# EAGLE design Breadboard (EAGLE 9.4.2)

## Sheet 1 of 2
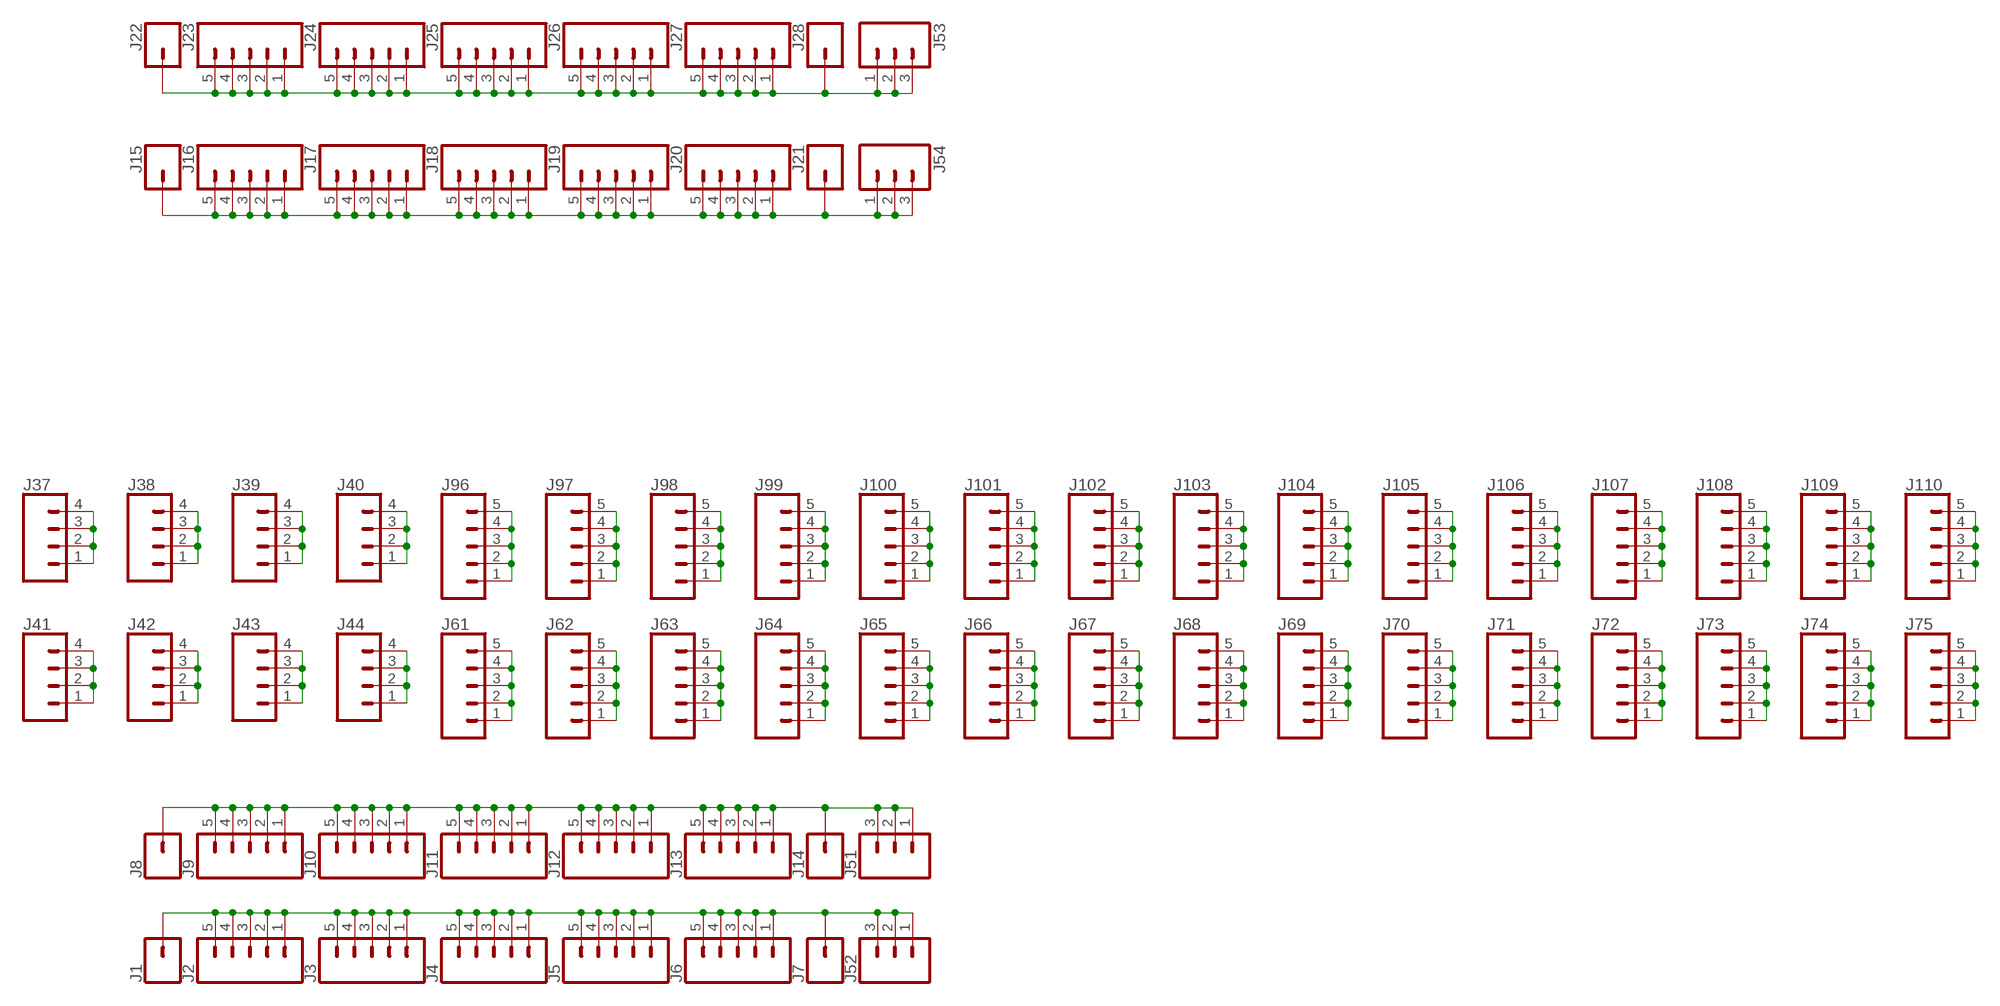
[diagram p0: schematic, sheet 1, part 1 of 2]
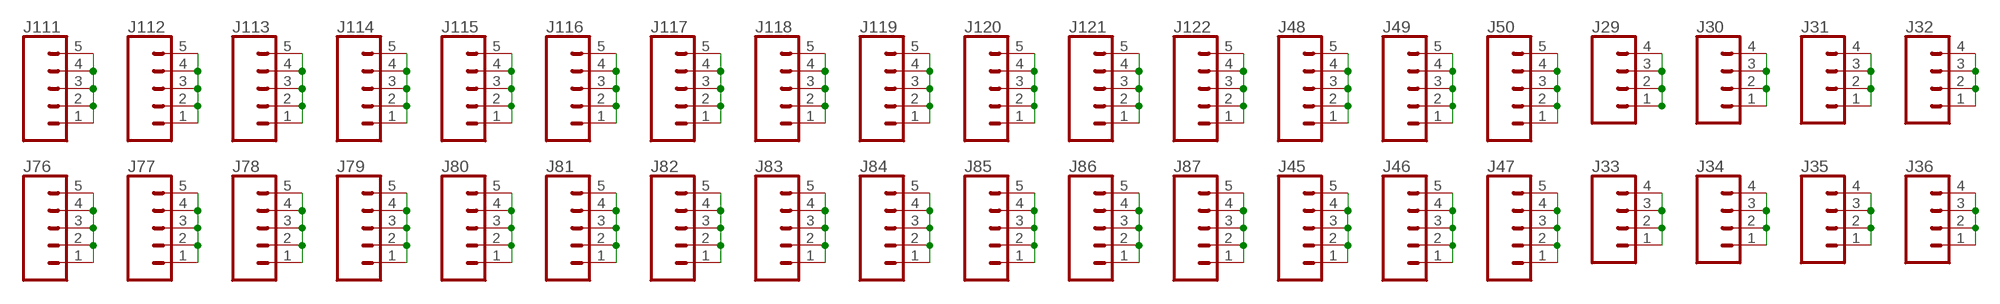
[diagram p1: schematic, sheet 1, part 2 of 2]

### Parts
J1  CONN_01  [1X01]
J2  CONN_05  [1X05]
J3  CONN_05  [1X05]
J4  CONN_05  [1X05]
J5  CONN_05  [1X05]
J6  CONN_05  [1X05]
J7  CONN_01  [1X01]
J8  CONN_01  [1X01]
J9  CONN_05  [1X05]
J10  CONN_05  [1X05]
J11  CONN_05  [1X05]
J12  CONN_05  [1X05]
J13  CONN_05  [1X05]
J14  CONN_01  [1X01]
J15  CONN_01  [1X01]
J16  CONN_05  [1X05]
J17  CONN_05  [1X05]
J18  CONN_05  [1X05]
J19  CONN_05  [1X05]
J20  CONN_05  [1X05]
J21  CONN_01  [1X01]
J22  CONN_01  [1X01]
J23  CONN_05  [1X05]
J24  CONN_05  [1X05]
J25  CONN_05  [1X05]
J26  CONN_05  [1X05]
J27  CONN_05  [1X05]
J28  CONN_01  [1X01]
J29  CONN_04PTH  [1X04]
J30  CONN_04PTH  [1X04]
J31  CONN_04PTH  [1X04]
J32  CONN_04PTH  [1X04]
J33  CONN_04PTH  [1X04]
J34  CONN_04PTH  [1X04]
J35  CONN_04PTH  [1X04]
J36  CONN_04PTH  [1X04]
J37  CONN_04PTH  [1X04]
J38  CONN_04PTH  [1X04]
J39  CONN_04PTH  [1X04]
J40  CONN_04PTH  [1X04]
J41  CONN_04PTH  [1X04]
J42  CONN_04PTH  [1X04]
J43  CONN_04PTH  [1X04]
J44  CONN_04PTH  [1X04]
J45  CONN_05  [1X05]
J46  CONN_05  [1X05]
J47  CONN_05  [1X05]
J48  CONN_05  [1X05]
J49  CONN_05  [1X05]
J50  CONN_05  [1X05]
J51  455-1750-1-ND  CONN_03  [1X03]
J52  455-1750-1-ND  CONN_03  [1X03]
J53  455-1750-1-ND  CONN_03  [1X03]
J54  455-1750-1-ND  CONN_03  [1X03]
J61  CONN_05  [1X05]
J62  CONN_05  [1X05]
J63  CONN_05  [1X05]
J64  CONN_05  [1X05]
J65  CONN_05  [1X05]
J66  CONN_05  [1X05]
J67  CONN_05  [1X05]
J68  CONN_05  [1X05]
J69  CONN_05  [1X05]
J70  CONN_05  [1X05]
J71  CONN_05  [1X05]
J72  CONN_05  [1X05]
J73  CONN_05  [1X05]
J74  CONN_05  [1X05]
J75  CONN_05  [1X05]
J76  CONN_05  [1X05]
J77  CONN_05  [1X05]
J78  CONN_05  [1X05]
J79  CONN_05  [1X05]
J80  CONN_05  [1X05]
J81  CONN_05  [1X05]
J82  CONN_05  [1X05]
J83  CONN_05  [1X05]
J84  CONN_05  [1X05]
J85  CONN_05  [1X05]
J86  CONN_05  [1X05]
J87  CONN_05  [1X05]
J96  CONN_05  [1X05]
J97  CONN_05  [1X05]
J98  CONN_05  [1X05]
J99  CONN_05  [1X05]
J100  CONN_05  [1X05]
J101  CONN_05  [1X05]
J102  CONN_05  [1X05]
J103  CONN_05  [1X05]
J104  CONN_05  [1X05]
J105  CONN_05  [1X05]
J106  CONN_05  [1X05]
J107  CONN_05  [1X05]
J108  CONN_05  [1X05]
J109  CONN_05  [1X05]
J110  CONN_05  [1X05]
J111  CONN_05  [1X05]
J112  CONN_05  [1X05]
J113  CONN_05  [1X05]
J114  CONN_05  [1X05]
J115  CONN_05  [1X05]
J116  CONN_05  [1X05]
J117  CONN_05  [1X05]
J118  CONN_05  [1X05]
J119  CONN_05  [1X05]
J120  CONN_05  [1X05]
J121  CONN_05  [1X05]
J122  CONN_05  [1X05]

### Nets
N$1: J1.1 J2.1 J2.2 J2.3 J2.4 J2.5 J3.1 J3.2 J3.3 J3.4 J3.5 J4.1 J4.2 J4.3 J4.4 J4.5 J5.1 J5.2 J5.3 J5.4 J5.5 J6.1 J6.2 J6.3 J6.4 J6.5 J7.1 J52.1 J52.2 J52.3
N$2: J8.1 J9.1 J9.2 J9.3 J9.4 J9.5 J10.1 J10.2 J10.3 J10.4 J10.5 J11.1 J11.2 J11.3 J11.4 J11.5 J12.1 J12.2 J12.3 J12.4 J12.5 J13.1 J13.2 J13.3 J13.4 J13.5 J14.1 J51.1 J51.2 J51.3
N$3: J15.1 J16.1 J16.2 J16.3 J16.4 J16.5 J17.1 J17.2 J17.3 J17.4 J17.5 J18.1 J18.2 J18.3 J18.4 J18.5 J19.1 J19.2 J19.3 J19.4 J19.5 J20.1 J20.2 J20.3 J20.4 J20.5 J21.1 J54.1 J54.2 J54.3
N$4: J22.1 J23.1 J23.2 J23.3 J23.4 J23.5 J24.1 J24.2 J24.3 J24.4 J24.5 J25.1 J25.2 J25.3 J25.4 J25.5 J26.1 J26.2 J26.3 J26.4 J26.5 J27.1 J27.2 J27.3 J27.4 J27.5 J28.1 J53.1 J53.2 J53.3
N$5: J41.1 J41.2 J41.3 J41.4
N$6: J42.1 J42.2 J42.3 J42.4
N$7: J43.1 J43.2 J43.3 J43.4
N$8: J44.1 J44.2 J44.3 J44.4
N$9: J61.1 J61.2 J61.3 J61.4 J61.5
N$10: J62.1 J62.2 J62.3 J62.4 J62.5
N$11: J63.1 J63.2 J63.3 J63.4 J63.5
N$12: J64.1 J64.2 J64.3 J64.4 J64.5
N$13: J65.1 J65.2 J65.3 J65.4 J65.5
N$14: J66.1 J66.2 J66.3 J66.4 J66.5
N$15: J67.1 J67.2 J67.3 J67.4 J67.5
N$16: J68.1 J68.2 J68.3 J68.4 J68.5
N$17: J69.1 J69.2 J69.3 J69.4 J69.5
N$18: J70.1 J70.2 J70.3 J70.4 J70.5
N$19: J71.1 J71.2 J71.3 J71.4 J71.5
N$20: J72.1 J72.2 J72.3 J72.4 J72.5
N$21: J73.1 J73.2 J73.3 J73.4 J73.5
N$22: J74.1 J74.2 J74.3 J74.4 J74.5
N$23: J75.1 J75.2 J75.3 J75.4 J75.5
N$24: J76.1 J76.2 J76.3 J76.4 J76.5
N$25: J77.1 J77.2 J77.3 J77.4 J77.5
N$26: J78.1 J78.2 J78.3 J78.4 J78.5
N$27: J79.1 J79.2 J79.3 J79.4 J79.5
N$28: J80.1 J80.2 J80.3 J80.4 J80.5
N$29: J81.1 J81.2 J81.3 J81.4 J81.5
N$30: J82.1 J82.2 J82.3 J82.4 J82.5
N$31: J83.1 J83.2 J83.3 J83.4 J83.5
N$32: J84.1 J84.2 J84.3 J84.4 J84.5
N$33: J85.1 J85.2 J85.3 J85.4 J85.5
N$34: J86.1 J86.2 J86.3 J86.4 J86.5
N$35: J87.1 J87.2 J87.3 J87.4 J87.5
N$36: J33.1 J33.2 J33.3 J33.4
N$37: J34.1 J34.2 J34.3 J34.4
N$38: J35.1 J35.2 J35.3 J35.4
N$39: J36.1 J36.2 J36.3 J36.4
N$40: J37.1 J37.2 J37.3 J37.4
N$41: J38.1 J38.2 J38.3 J38.4
N$42: J39.1 J39.2 J39.3 J39.4
N$43: J40.1 J40.2 J40.3 J40.4
N$44: J96.1 J96.2 J96.3 J96.4 J96.5
N$45: J97.1 J97.2 J97.3 J97.4 J97.5
N$46: J98.1 J98.2 J98.3 J98.4 J98.5
N$47: J99.1 J99.2 J99.3 J99.4 J99.5
N$48: J100.1 J100.2 J100.3 J100.4 J100.5
N$49: J101.1 J101.2 J101.3 J101.4 J101.5
N$50: J102.1 J102.2 J102.3 J102.4 J102.5
N$51: J103.1 J103.2 J103.3 J103.4 J103.5
N$52: J104.1 J104.2 J104.3 J104.4 J104.5
N$53: J105.1 J105.2 J105.3 J105.4 J105.5
N$54: J106.1 J106.2 J106.3 J106.4 J106.5
N$55: J107.1 J107.2 J107.3 J107.4 J107.5
N$56: J108.1 J108.2 J108.3 J108.4 J108.5
N$57: J109.1 J109.2 J109.3 J109.4 J109.5
N$58: J110.1 J110.2 J110.3 J110.4 J110.5
N$59: J111.1 J111.2 J111.3 J111.4 J111.5
N$60: J112.1 J112.2 J112.3 J112.4 J112.5
N$61: J113.1 J113.2 J113.3 J113.4 J113.5
N$62: J114.1 J114.2 J114.3 J114.4 J114.5
N$63: J115.1 J115.2 J115.3 J115.4 J115.5
N$64: J116.1 J116.2 J116.3 J116.4 J116.5
N$65: J117.1 J117.2 J117.3 J117.4 J117.5
N$66: J118.1 J118.2 J118.3 J118.4 J118.5
N$67: J119.1 J119.2 J119.3 J119.4 J119.5
N$68: J120.1 J120.2 J120.3 J120.4 J120.5
N$69: J121.1 J121.2 J121.3 J121.4 J121.5
N$70: J122.1 J122.2 J122.3 J122.4 J122.5
N$71: J29.1 J29.2 J29.3 J29.4
N$72: J30.1 J30.2 J30.3 J30.4
N$73: J31.1 J31.2 J31.3 J31.4
N$74: J32.1 J32.2 J32.3 J32.4
N$75: J48.1 J48.2 J48.3 J48.4 J48.5
N$76: J45.1 J45.2 J45.3 J45.4 J45.5
N$77: J46.1 J46.2 J46.3 J46.4 J46.5
N$78: J47.1 J47.2 J47.3 J47.4 J47.5
N$79: J49.1 J49.2 J49.3 J49.4 J49.5
N$80: J50.1 J50.2 J50.3 J50.4 J50.5

## Sheet 2 of 2
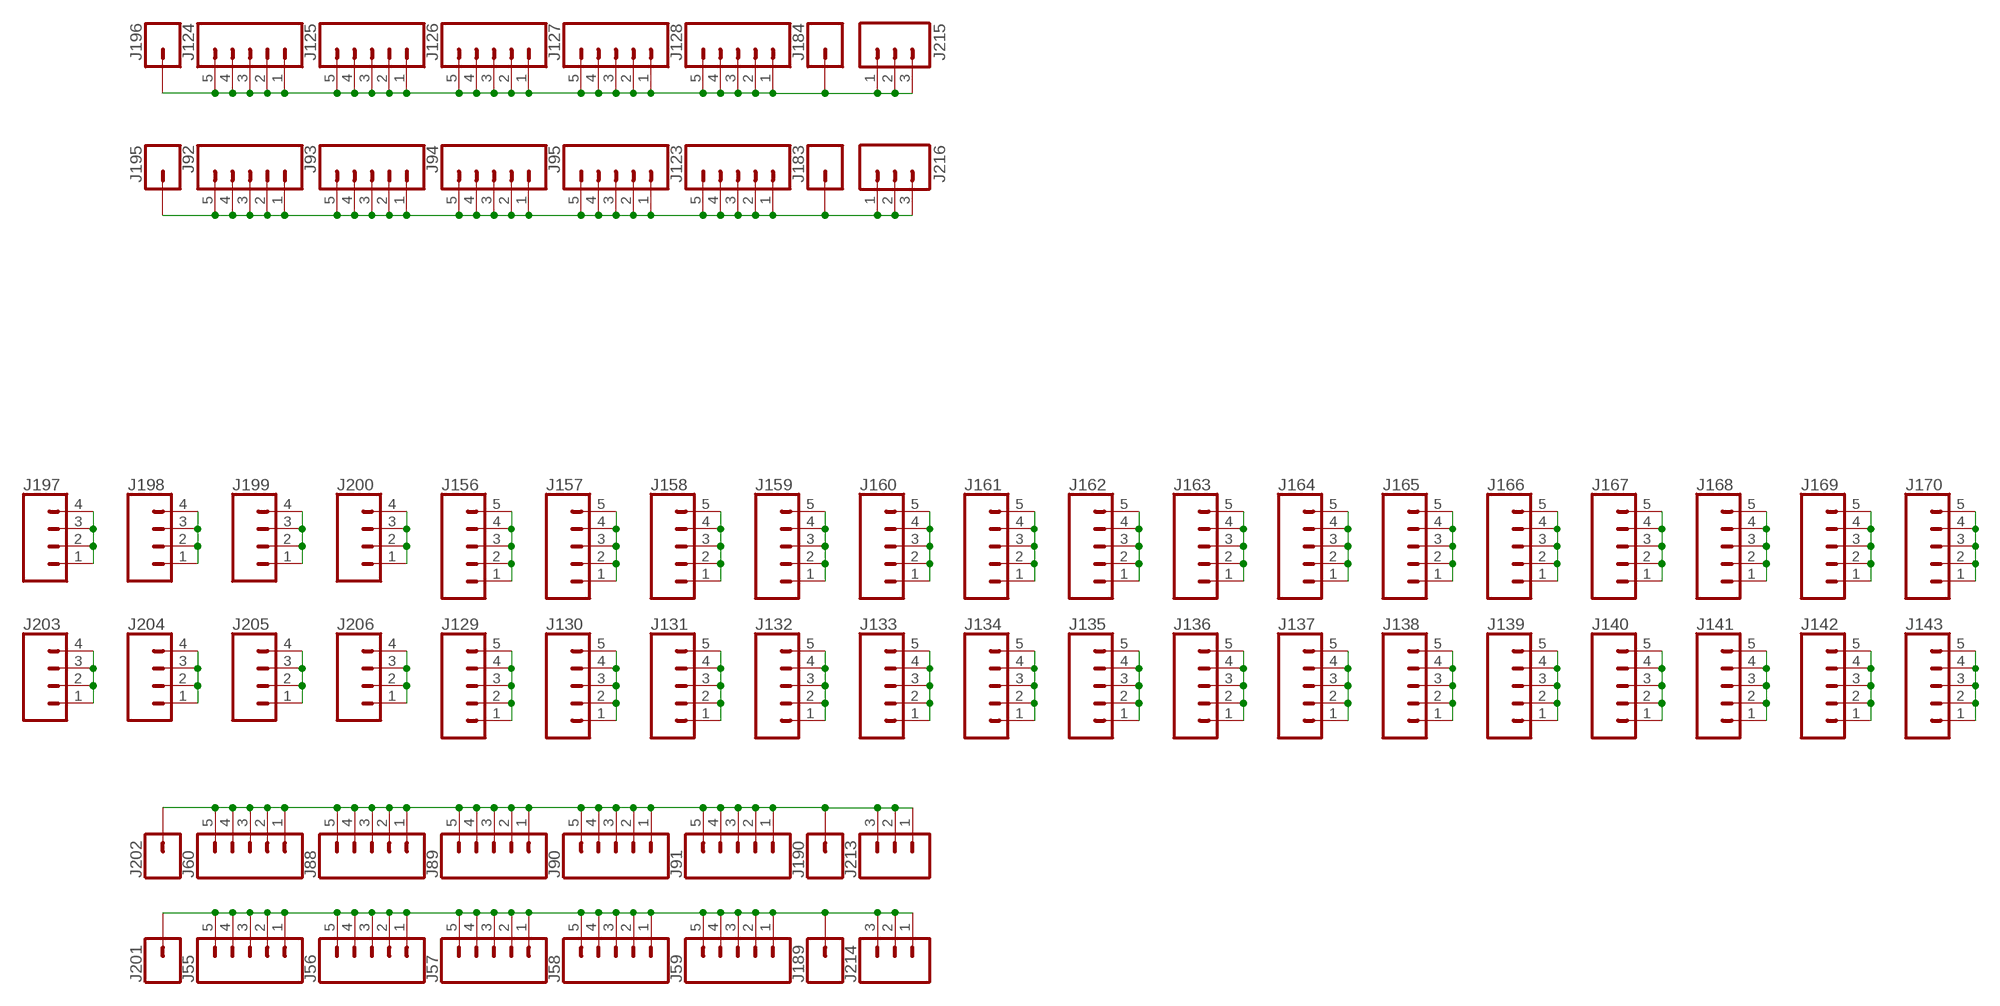
[diagram p2: schematic, sheet 2, part 1 of 2]
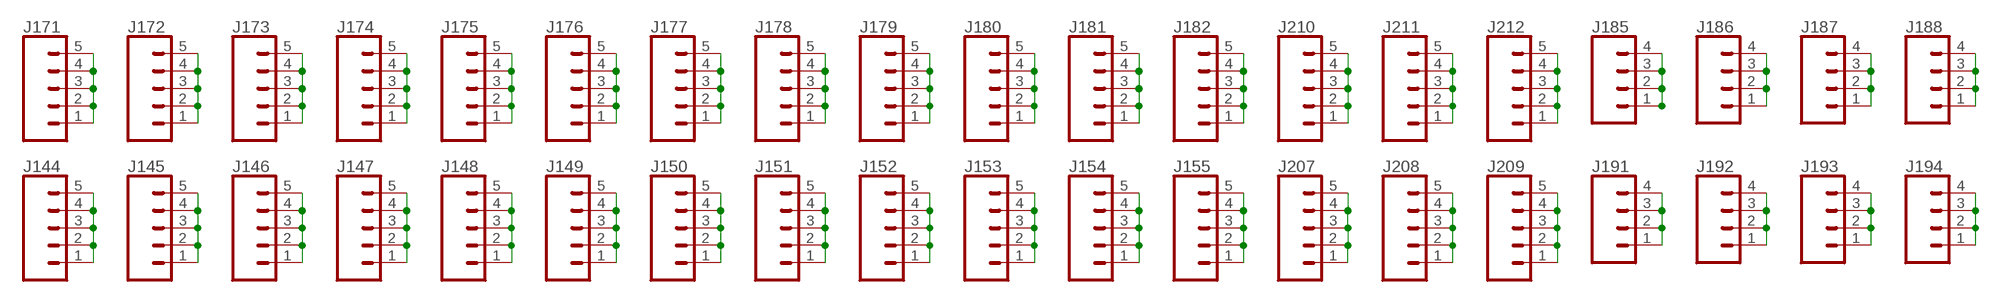
[diagram p3: schematic, sheet 2, part 2 of 2]

### Parts
J55  CONN_05  [1X05]
J56  CONN_05  [1X05]
J57  CONN_05  [1X05]
J58  CONN_05  [1X05]
J59  CONN_05  [1X05]
J60  CONN_05  [1X05]
J88  CONN_05  [1X05]
J89  CONN_05  [1X05]
J90  CONN_05  [1X05]
J91  CONN_05  [1X05]
J92  CONN_05  [1X05]
J93  CONN_05  [1X05]
J94  CONN_05  [1X05]
J95  CONN_05  [1X05]
J123  CONN_05  [1X05]
J124  CONN_05  [1X05]
J125  CONN_05  [1X05]
J126  CONN_05  [1X05]
J127  CONN_05  [1X05]
J128  CONN_05  [1X05]
J129  CONN_05  [1X05]
J130  CONN_05  [1X05]
J131  CONN_05  [1X05]
J132  CONN_05  [1X05]
J133  CONN_05  [1X05]
J134  CONN_05  [1X05]
J135  CONN_05  [1X05]
J136  CONN_05  [1X05]
J137  CONN_05  [1X05]
J138  CONN_05  [1X05]
J139  CONN_05  [1X05]
J140  CONN_05  [1X05]
J141  CONN_05  [1X05]
J142  CONN_05  [1X05]
J143  CONN_05  [1X05]
J144  CONN_05  [1X05]
J145  CONN_05  [1X05]
J146  CONN_05  [1X05]
J147  CONN_05  [1X05]
J148  CONN_05  [1X05]
J149  CONN_05  [1X05]
J150  CONN_05  [1X05]
J151  CONN_05  [1X05]
J152  CONN_05  [1X05]
J153  CONN_05  [1X05]
J154  CONN_05  [1X05]
J155  CONN_05  [1X05]
J156  CONN_05  [1X05]
J157  CONN_05  [1X05]
J158  CONN_05  [1X05]
J159  CONN_05  [1X05]
J160  CONN_05  [1X05]
J161  CONN_05  [1X05]
J162  CONN_05  [1X05]
J163  CONN_05  [1X05]
J164  CONN_05  [1X05]
J165  CONN_05  [1X05]
J166  CONN_05  [1X05]
J167  CONN_05  [1X05]
J168  CONN_05  [1X05]
J169  CONN_05  [1X05]
J170  CONN_05  [1X05]
J171  CONN_05  [1X05]
J172  CONN_05  [1X05]
J173  CONN_05  [1X05]
J174  CONN_05  [1X05]
J175  CONN_05  [1X05]
J176  CONN_05  [1X05]
J177  CONN_05  [1X05]
J178  CONN_05  [1X05]
J179  CONN_05  [1X05]
J180  CONN_05  [1X05]
J181  CONN_05  [1X05]
J182  CONN_05  [1X05]
J183  CONN_01  [1X01]
J184  CONN_01  [1X01]
J185  CONN_04PTH  [1X04]
J186  CONN_04PTH  [1X04]
J187  CONN_04PTH  [1X04]
J188  CONN_04PTH  [1X04]
J189  CONN_01  [1X01]
J190  CONN_01  [1X01]
J191  CONN_04PTH  [1X04]
J192  CONN_04PTH  [1X04]
J193  CONN_04PTH  [1X04]
J194  CONN_04PTH  [1X04]
J195  CONN_01  [1X01]
J196  CONN_01  [1X01]
J197  CONN_04PTH  [1X04]
J198  CONN_04PTH  [1X04]
J199  CONN_04PTH  [1X04]
J200  CONN_04PTH  [1X04]
J201  CONN_01  [1X01]
J202  CONN_01  [1X01]
J203  CONN_04PTH  [1X04]
J204  CONN_04PTH  [1X04]
J205  CONN_04PTH  [1X04]
J206  CONN_04PTH  [1X04]
J207  CONN_05  [1X05]
J208  CONN_05  [1X05]
J209  CONN_05  [1X05]
J210  CONN_05  [1X05]
J211  CONN_05  [1X05]
J212  CONN_05  [1X05]
J213  455-1750-1-ND  CONN_03  [1X03]
J214  455-1750-1-ND  CONN_03  [1X03]
J215  455-1750-1-ND  CONN_03  [1X03]
J216  455-1750-1-ND  CONN_03  [1X03]

### Nets
N$81: J55.1 J55.2 J55.3 J55.4 J55.5 J56.1 J56.2 J56.3 J56.4 J56.5 J57.1 J57.2 J57.3 J57.4 J57.5 J58.1 J58.2 J58.3 J58.4 J58.5 J59.1 J59.2 J59.3 J59.4 J59.5 J189.1 J201.1 J214.1 J214.2 J214.3
N$82: J60.1 J60.2 J60.3 J60.4 J60.5 J88.1 J88.2 J88.3 J88.4 J88.5 J89.1 J89.2 J89.3 J89.4 J89.5 J90.1 J90.2 J90.3 J90.4 J90.5 J91.1 J91.2 J91.3 J91.4 J91.5 J190.1 J202.1 J213.1 J213.2 J213.3
N$83: J92.1 J92.2 J92.3 J92.4 J92.5 J93.1 J93.2 J93.3 J93.4 J93.5 J94.1 J94.2 J94.3 J94.4 J94.5 J95.1 J95.2 J95.3 J95.4 J95.5 J123.1 J123.2 J123.3 J123.4 J123.5 J183.1 J195.1 J216.1 J216.2 J216.3
N$84: J124.1 J124.2 J124.3 J124.4 J124.5 J125.1 J125.2 J125.3 J125.4 J125.5 J126.1 J126.2 J126.3 J126.4 J126.5 J127.1 J127.2 J127.3 J127.4 J127.5 J128.1 J128.2 J128.3 J128.4 J128.5 J184.1 J196.1 J215.1 J215.2 J215.3
N$85: J203.1 J203.2 J203.3 J203.4
N$86: J204.1 J204.2 J204.3 J204.4
N$87: J205.1 J205.2 J205.3 J205.4
N$88: J206.1 J206.2 J206.3 J206.4
N$89: J129.1 J129.2 J129.3 J129.4 J129.5
N$90: J130.1 J130.2 J130.3 J130.4 J130.5
N$91: J131.1 J131.2 J131.3 J131.4 J131.5
N$92: J132.1 J132.2 J132.3 J132.4 J132.5
N$93: J133.1 J133.2 J133.3 J133.4 J133.5
N$94: J134.1 J134.2 J134.3 J134.4 J134.5
N$95: J135.1 J135.2 J135.3 J135.4 J135.5
N$96: J136.1 J136.2 J136.3 J136.4 J136.5
N$97: J137.1 J137.2 J137.3 J137.4 J137.5
N$98: J138.1 J138.2 J138.3 J138.4 J138.5
N$99: J139.1 J139.2 J139.3 J139.4 J139.5
N$100: J140.1 J140.2 J140.3 J140.4 J140.5
N$101: J141.1 J141.2 J141.3 J141.4 J141.5
N$102: J142.1 J142.2 J142.3 J142.4 J142.5
N$103: J143.1 J143.2 J143.3 J143.4 J143.5
N$104: J144.1 J144.2 J144.3 J144.4 J144.5
N$105: J145.1 J145.2 J145.3 J145.4 J145.5
N$106: J146.1 J146.2 J146.3 J146.4 J146.5
N$107: J147.1 J147.2 J147.3 J147.4 J147.5
N$108: J148.1 J148.2 J148.3 J148.4 J148.5
N$109: J149.1 J149.2 J149.3 J149.4 J149.5
N$110: J150.1 J150.2 J150.3 J150.4 J150.5
N$111: J151.1 J151.2 J151.3 J151.4 J151.5
N$112: J152.1 J152.2 J152.3 J152.4 J152.5
N$113: J153.1 J153.2 J153.3 J153.4 J153.5
N$114: J154.1 J154.2 J154.3 J154.4 J154.5
N$115: J155.1 J155.2 J155.3 J155.4 J155.5
N$116: J191.1 J191.2 J191.3 J191.4
N$117: J192.1 J192.2 J192.3 J192.4
N$118: J193.1 J193.2 J193.3 J193.4
N$119: J194.1 J194.2 J194.3 J194.4
N$120: J197.1 J197.2 J197.3 J197.4
N$121: J198.1 J198.2 J198.3 J198.4
N$122: J199.1 J199.2 J199.3 J199.4
N$123: J200.1 J200.2 J200.3 J200.4
N$124: J156.1 J156.2 J156.3 J156.4 J156.5
N$125: J157.1 J157.2 J157.3 J157.4 J157.5
N$126: J158.1 J158.2 J158.3 J158.4 J158.5
N$127: J159.1 J159.2 J159.3 J159.4 J159.5
N$128: J160.1 J160.2 J160.3 J160.4 J160.5
N$129: J161.1 J161.2 J161.3 J161.4 J161.5
N$130: J162.1 J162.2 J162.3 J162.4 J162.5
N$131: J163.1 J163.2 J163.3 J163.4 J163.5
N$132: J164.1 J164.2 J164.3 J164.4 J164.5
N$133: J165.1 J165.2 J165.3 J165.4 J165.5
N$134: J166.1 J166.2 J166.3 J166.4 J166.5
N$135: J167.1 J167.2 J167.3 J167.4 J167.5
N$136: J168.1 J168.2 J168.3 J168.4 J168.5
N$137: J169.1 J169.2 J169.3 J169.4 J169.5
N$138: J170.1 J170.2 J170.3 J170.4 J170.5
N$139: J171.1 J171.2 J171.3 J171.4 J171.5
N$140: J172.1 J172.2 J172.3 J172.4 J172.5
N$141: J173.1 J173.2 J173.3 J173.4 J173.5
N$142: J174.1 J174.2 J174.3 J174.4 J174.5
N$143: J175.1 J175.2 J175.3 J175.4 J175.5
N$144: J176.1 J176.2 J176.3 J176.4 J176.5
N$145: J177.1 J177.2 J177.3 J177.4 J177.5
N$146: J178.1 J178.2 J178.3 J178.4 J178.5
N$147: J179.1 J179.2 J179.3 J179.4 J179.5
N$148: J180.1 J180.2 J180.3 J180.4 J180.5
N$149: J181.1 J181.2 J181.3 J181.4 J181.5
N$150: J182.1 J182.2 J182.3 J182.4 J182.5
N$151: J185.1 J185.2 J185.3 J185.4
N$152: J186.1 J186.2 J186.3 J186.4
N$153: J187.1 J187.2 J187.3 J187.4
N$154: J188.1 J188.2 J188.3 J188.4
N$155: J207.1 J207.2 J207.3 J207.4 J207.5
N$156: J208.1 J208.2 J208.3 J208.4 J208.5
N$157: J209.1 J209.2 J209.3 J209.4 J209.5
N$158: J210.1 J210.2 J210.3 J210.4 J210.5
N$159: J211.1 J211.2 J211.3 J211.4 J211.5
N$160: J212.1 J212.2 J212.3 J212.4 J212.5

## Library data of the parts
J1 J7 J8 J14 J15 J21 J22 J28 J183 J184 J189 J190 J195 J196 J201 J202 = SparkFun-Connectors:CONN_01: Single connection point. Often used as Generic Header-pin footprint for 0.1 inch spaced/style header connections On any of the 0.1 inch spaced packages, you can populate with these: Break Away Headers - Straight <https://www.sparkfun.com/products/116> (PRT-00116) Break Away Male Headers - Right Angle <https://www.sparkfun.com/products/553> (PRT-00553) Female Headers <https://www.sparkfun.com/products/115> (PRT-00115) Break Away Headers - Machine Pin <https://www.sparkfun.com/products/117> (PRT-00117) Break Away Female Headers - Swiss Machine Pin <https://www.sparkfun.com/products/743> (PRT-00743) This device is also useful as a general connection point to wire up your design to another part of your project. Our various solder wires solder well into these plated through hole pads. Hook-Up Wire - Assortment (Stranded, 22 AWG) <https://www.sparkfun.com/products/11375> (PRT-11375) Hook-Up Wire - Assortment (Solid Core, 22 AWG) <https://www.sparkfun.com/products/11367> (PRT-11367) View the entire wire category on our website here <https://www.sparkfun.com/categories/141> Special notes: SMTSO-256-ET is a "flush mount" nut for a 4-40 screw. We mostly use this on specialty testbeds; it is a nice way to connect hardware to your PCB at an adjustable hieght. Also note, the SNAP packages are for using a snappable style connector. We sell a baggie of snaps and they are also used on two LilyPad designs: Snap Assortment - 30 pack (male and female) <https://www.sparkfun.com/products/11347> (DEV-11347) LilyPad Arduino SimpleSnap <https://www.sparkfun.com/products/10941> (DEV-10941) LilyPad SimpleSnap Protoboard <https://www.sparkfun.com/products/10940> (DEV-10940)
J2-J6 J9-J13 J16-J20 J23-J27 J45-J50 J55-J182 J207-J212 = SparkFun-Connectors:CONN_05: Multi connection point. Often used as Generic Header-pin footprint for 0.1 inch spaced/style header connections On any of the 0.1 inch spaced packages, you can populate with these: Break Away Headers - Straight <https://www.sparkfun.com/products/116> (PRT-00116) Break Away Male Headers - Right Angle <https://www.sparkfun.com/products/553> (PRT-00553) Female Headers <https://www.sparkfun.com/products/115> (PRT-00115) Break Away Headers - Machine Pin <https://www.sparkfun.com/products/117> (PRT-00117) Break Away Female Headers - Swiss Machine Pin <https://www.sparkfun.com/products/743> (PRT-00743) For SCREWTERMINALS and SPRING TERMINALS visit here: Screw Terimnals on SparkFun.com <https://www.sparkfun.com/search/results?term=Screw+Terminals> (5mm/3.5mm/2.54mm spacing) This device is also useful as a general connection point to wire up your design to another part of your project. Our various solder wires solder well into these plated through hole pads. Hook-Up Wire - Assortment (Stranded, 22 AWG) <https://www.sparkfun.com/products/11375> (PRT-11375) Hook-Up Wire - Assortment (Solid Core, 22 AWG) <https://www.sparkfun.com/products/11367> (PRT-11367) View the entire wire category on our website here <https://www.sparkfun.com/categories/141> Special notes: Molex polarized connector foot print use with SKU : PRT-08231 with associated crimp pins and housings. 1MM SMD Version SKU: PRT-10208
J29-J44 J185-J188 J191-J194 J197-J200 J203-J206 = SparkFun-Connectors:CONN_04: Multi connection point. Often used as Generic Header-pin footprint for 0.1 inch spaced/style header connections On any of the 0.1 inch spaced packages, you can populate with these: Break Away Headers - Straight <https://www.sparkfun.com/products/116> (PRT-00116) Break Away Male Headers - Right Angle <https://www.sparkfun.com/products/553> (PRT-00553) Female Headers <https://www.sparkfun.com/products/115> (PRT-00115) Break Away Headers - Machine Pin <https://www.sparkfun.com/products/117> (PRT-00117) Break Away Female Headers - Swiss Machine Pin <https://www.sparkfun.com/products/743> (PRT-00743) For SCREWTERMINALS and SPRING TERMINALS visit here: Screw Terimnals on SparkFun.com <https://www.sparkfun.com/search/results?term=Screw+Terminals> (5mm/3.5mm/2.54mm spacing) This device is also useful as a general connection point to wire up your design to another part of your project. Our various solder wires solder well into these plated through hole pads. Hook-Up Wire - Assortment (Stranded, 22 AWG) <https://www.sparkfun.com/products/11375> (PRT-11375) Hook-Up Wire - Assortment (Solid Core, 22 AWG) <https://www.sparkfun.com/products/11367> (PRT-11367) View the entire wire category on our website here <https://www.sparkfun.com/categories/141> Special notes: Molex polarized connector foot print use with SKU : PRT-08231 with associated crimp pins and housings. 1MM SMD Version SKU: PRT-10208; PROD_ID: CONN-09696
J51-J54 J213-J216 = SparkFun-Connectors:CONN_03: Multi connection point. Often used as Generic Header-pin footprint for 0.1 inch spaced/style header connections On any of the 0.1 inch spaced packages, you can populate with these: Break Away Headers - Straight <https://www.sparkfun.com/products/116> (PRT-00116) Break Away Male Headers - Right Angle <https://www.sparkfun.com/products/553> (PRT-00553) Female Headers <https://www.sparkfun.com/products/115> (PRT-00115) Break Away Headers - Machine Pin <https://www.sparkfun.com/products/117> (PRT-00117) Break Away Female Headers - Swiss Machine Pin <https://www.sparkfun.com/products/743> (PRT-00743) Stackable Header - 3 Pin (Female, 0.1") <https://www.sparkfun.com/products/13875> (PRT-13875) For SCREWTERMINALS and SPRING TERMINALS visit here: Screw Terimnals on SparkFun.com <https://www.sparkfun.com/search/results?term=Screw+Terminals> (5mm/3.5mm/2.54mm spacing) This device is also useful as a general connection point to wire up your design to another part of your project. Our various solder wires solder well into these plated through hole pads. Hook-Up Wire - Assortment (Stranded, 22 AWG) <https://www.sparkfun.com/products/11375> (PRT-11375) Hook-Up Wire - Assortment (Solid Core, 22 AWG) <https://www.sparkfun.com/products/11367> (PRT-11367) View the entire wire category on our website here <https://www.sparkfun.com/categories/141> Special notes: Molex polarized connector foot print use with SKU : PRT-08232 with associated crimp pins and housings.; PROD_ID: XXX-00000

## Board
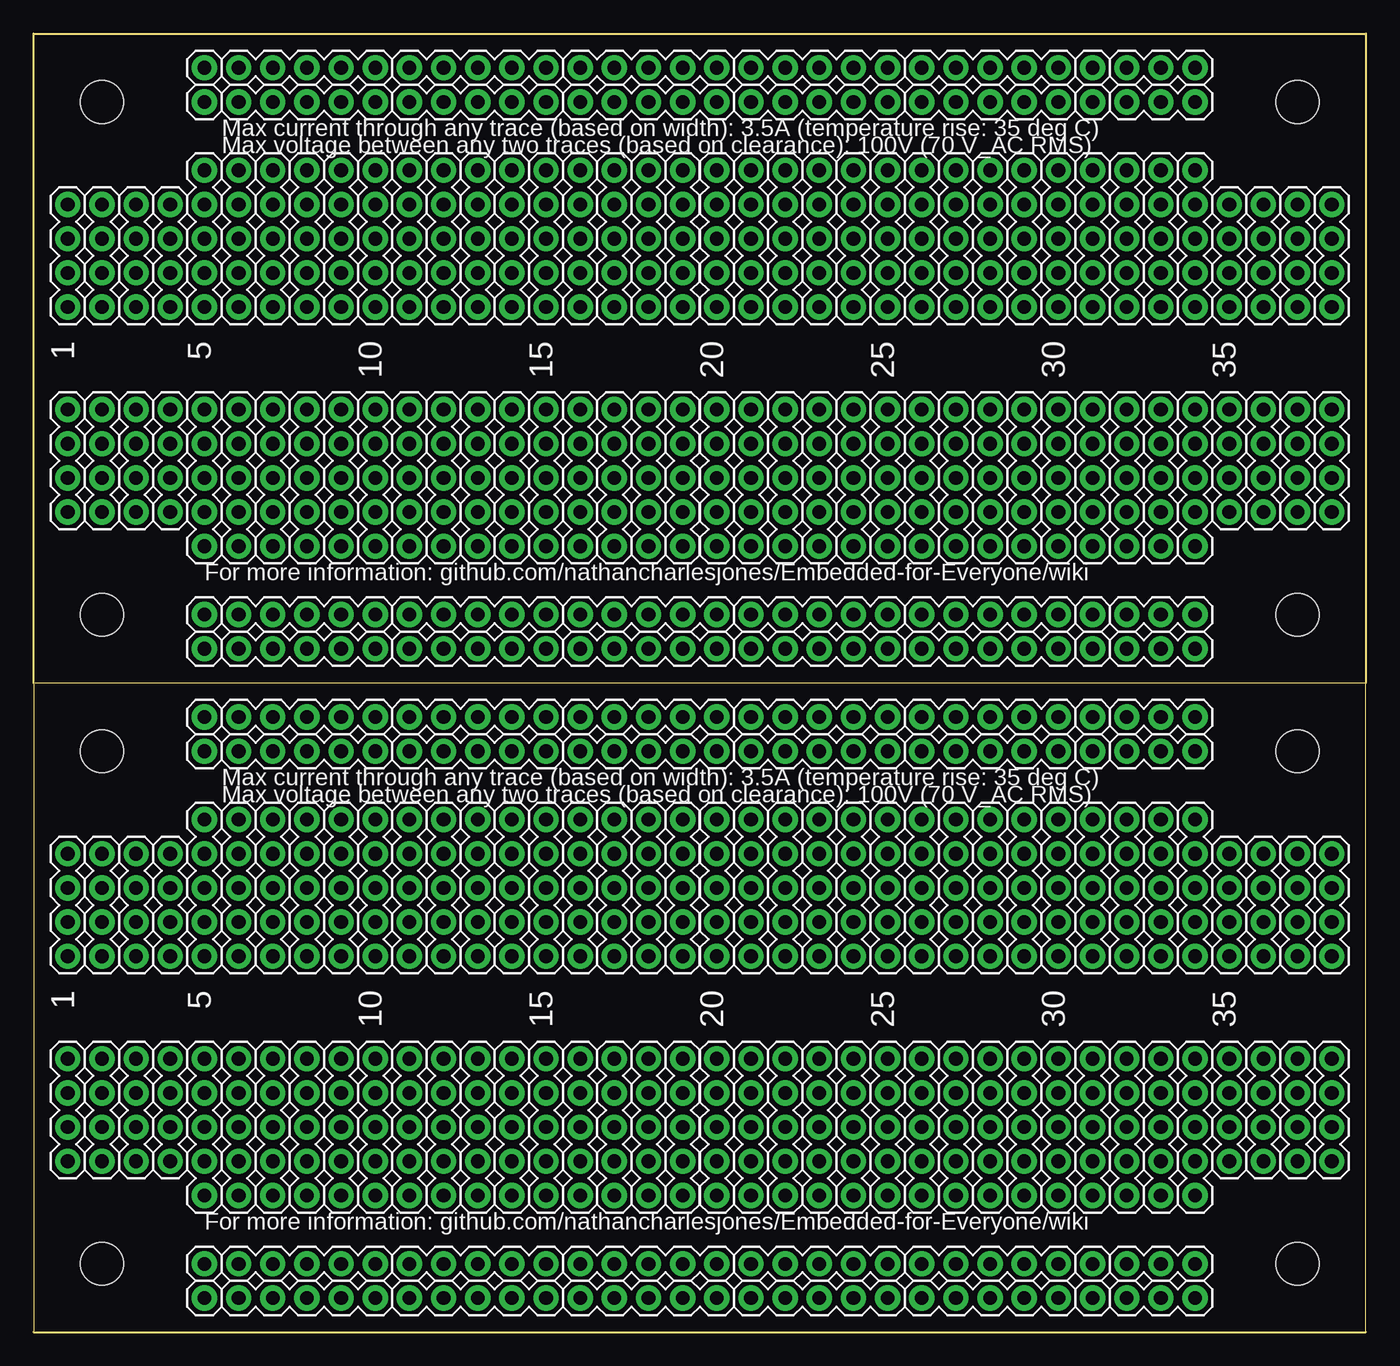
[diagram p4: board, top side]
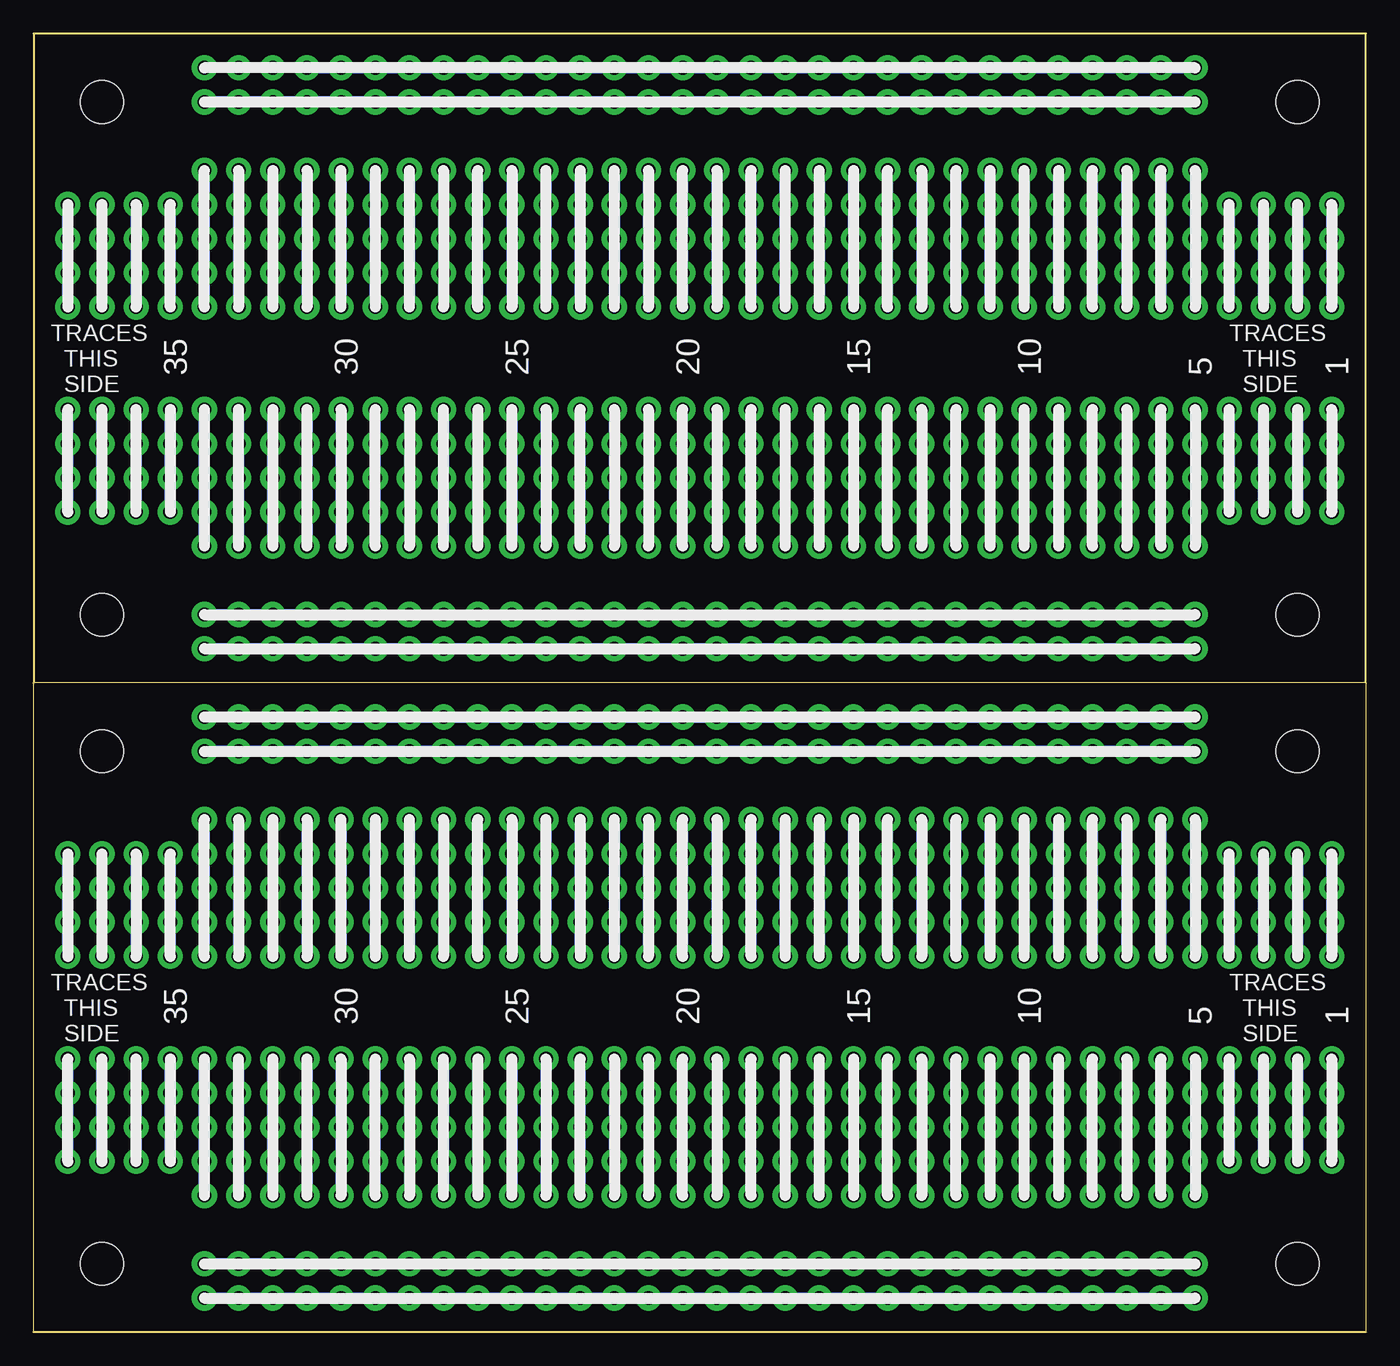
[diagram p5: board, bottom side, seen from below]

Size 99.06 x 96.52 mm. Coordinates in mm from the lower left corner, seen from the top.
Outline: 0,48.26 99.06,48.26
Outline: 99.06,48.26 99.06,0 0,0 0,48.26
Outline: 0,48.26 0,96.52 99.06,96.52 99.06,48.26
Copper layers (1*16): Top 0.035mm / dielectric 1.5mm / Bottom 0.035mm
Design rules "OthermillDRC_1_64_v2": minimum track width 16mil, minimum drill 31mil, track to track 0.39878125mm, track to pad 0.39878125mm, pad to pad 0.39878125mm, via to via 0.39878125mm, smd to smd 0mil, copper to edge 0mil, drill to drill 1mil, minimum pad ring 0mil, minimum via ring 15mil, stop-mask expansion 1mil, vias tented up to drill 30mil, thermal gap 10mil
Holes 3.17 mm at 93.98,43.18 93.98,5.08 5.08,43.18 5.08,5.08 93.98,91.44 93.98,53.34 5.08,91.44 5.08,53.34

### Footprints (pad centres in the part's own frame; a part is rotated, then mirrored left to right if it is on the bottom)
1X01 = drill 1.016 pad 1.88: 1 0,0
1X05 = drill 1.016 pad 1.88: 1 0,0; 2 2.54,0; 3 5.08,0; 4 7.62,0; 5 10.16,0
1X04 = drill 1.016 pad 1.88: 1 0,0; 2 2.54,0; 3 5.08,0; 4 7.62,0
1X03 = drill 1.016 pad 1.88: 1 0,0; 2 2.54,0; 3 5.08,0

### Placement (x,y rotation side)
J1  12.7,2.54 0 top
J2  15.24,2.54 0 top
J3  27.94,2.54 0 top
J4  40.64,2.54 0 top
J5  53.34,2.54 0 top
J6  66.04,2.54 0 top
J7  78.74,2.54 0 top
J8  12.7,5.08 0 top
J9  15.24,5.08 0 top
J10  27.94,5.08 0 top
J11  40.64,5.08 0 top
J12  53.34,5.08 0 top
J13  66.04,5.08 0 top
J14  78.74,5.08 0 top
J15  12.7,43.18 180 top
J16  15.24,43.18 0 top
J17  27.94,43.18 0 top
J18  40.64,43.18 0 top
J19  53.34,43.18 0 top
J20  66.04,43.18 0 top
J21  78.74,43.18 0 top
J22  12.7,45.72 180 top
J23  15.24,45.72 0 top
J24  27.94,45.72 0 top
J25  40.64,45.72 0 top
J26  53.34,45.72 0 top
J27  66.04,45.72 0 top
J28  78.74,45.72 0 top
J29  88.9,27.94 90 top
J30  91.44,27.94 90 top
J31  93.98,27.94 90 top
J32  96.52,27.94 90 top
J33  88.9,12.7 90 top
J34  91.44,12.7 90 top
J35  93.98,12.7 90 top
J36  96.52,12.7 90 top
J37  2.54,27.94 90 top
J38  5.08,27.94 90 top
J39  7.62,27.94 90 top
J40  10.16,27.94 90 top
J41  2.54,12.7 90 top
J42  5.08,12.7 90 top
J43  7.62,12.7 90 top
J44  10.16,12.7 90 top
J45  81.28,10.16 90 top
J46  83.82,10.16 90 top
J47  86.36,10.16 90 top
J48  81.28,27.94 90 top
J49  83.82,27.94 90 top
J50  86.36,27.94 90 top
J51  81.28,5.08 0 top
J52  81.28,2.54 0 top
J53  81.28,45.72 0 top
J54  81.28,43.18 0 top
J55  15.24,50.8 0 top
J56  27.94,50.8 0 top
J57  40.64,50.8 0 top
J58  53.34,50.8 0 top
J59  66.04,50.8 0 top
J60  15.24,53.34 0 top
J61  12.7,10.16 90 top
J62  15.24,10.16 90 top
J63  17.78,10.16 90 top
J64  20.32,10.16 90 top
J65  22.86,10.16 90 top
J66  25.4,10.16 90 top
J67  27.94,10.16 90 top
J68  30.48,10.16 90 top
J69  33.02,10.16 90 top
J70  35.56,10.16 90 top
J71  38.1,10.16 90 top
J72  40.64,10.16 90 top
J73  43.18,10.16 90 top
J74  45.72,10.16 90 top
J75  48.26,10.16 90 top
J76  50.8,10.16 90 top
J77  53.34,10.16 90 top
J78  55.88,10.16 90 top
J79  58.42,10.16 90 top
J80  60.96,10.16 90 top
J81  63.5,10.16 90 top
J82  66.04,10.16 90 top
J83  68.58,10.16 90 top
J84  71.12,10.16 90 top
J85  73.66,10.16 90 top
J86  76.2,10.16 90 top
J87  78.74,10.16 90 top
J88  27.94,53.34 0 top
J89  40.64,53.34 0 top
J90  53.34,53.34 0 top
J91  66.04,53.34 0 top
J92  15.24,91.44 0 top
J93  27.94,91.44 0 top
J94  40.64,91.44 0 top
J95  53.34,91.44 0 top
J96  12.7,27.94 90 top
J97  15.24,27.94 90 top
J98  17.78,27.94 90 top
J99  20.32,27.94 90 top
J100  22.86,27.94 90 top
J101  25.4,27.94 90 top
J102  27.94,27.94 90 top
J103  30.48,27.94 90 top
J104  33.02,27.94 90 top
J105  35.56,27.94 90 top
J106  38.1,27.94 90 top
J107  40.64,27.94 90 top
J108  43.18,27.94 90 top
J109  45.72,27.94 90 top
J110  48.26,27.94 90 top
J111  50.8,27.94 90 top
J112  53.34,27.94 90 top
J113  55.88,27.94 90 top
J114  58.42,27.94 90 top
J115  60.96,27.94 90 top
J116  63.5,27.94 90 top
J117  66.04,27.94 90 top
J118  68.58,27.94 90 top
J119  71.12,27.94 90 top
J120  73.66,27.94 90 top
J121  76.2,27.94 90 top
J122  78.74,27.94 90 top
J123  66.04,91.44 0 top
J124  15.24,93.98 0 top
J125  27.94,93.98 0 top
J126  40.64,93.98 0 top
J127  53.34,93.98 0 top
J128  66.04,93.98 0 top
J129  12.7,58.42 90 top
J130  15.24,58.42 90 top
J131  17.78,58.42 90 top
J132  20.32,58.42 90 top
J133  22.86,58.42 90 top
J134  25.4,58.42 90 top
J135  27.94,58.42 90 top
J136  30.48,58.42 90 top
J137  33.02,58.42 90 top
J138  35.56,58.42 90 top
J139  38.1,58.42 90 top
J140  40.64,58.42 90 top
J141  43.18,58.42 90 top
J142  45.72,58.42 90 top
J143  48.26,58.42 90 top
J144  50.8,58.42 90 top
J145  53.34,58.42 90 top
J146  55.88,58.42 90 top
J147  58.42,58.42 90 top
J148  60.96,58.42 90 top
J149  63.5,58.42 90 top
J150  66.04,58.42 90 top
J151  68.58,58.42 90 top
J152  71.12,58.42 90 top
J153  73.66,58.42 90 top
J154  76.2,58.42 90 top
J155  78.74,58.42 90 top
J156  12.7,76.2 90 top
J157  15.24,76.2 90 top
J158  17.78,76.2 90 top
J159  20.32,76.2 90 top
J160  22.86,76.2 90 top
J161  25.4,76.2 90 top
J162  27.94,76.2 90 top
J163  30.48,76.2 90 top
J164  33.02,76.2 90 top
J165  35.56,76.2 90 top
J166  38.1,76.2 90 top
J167  40.64,76.2 90 top
J168  43.18,76.2 90 top
J169  45.72,76.2 90 top
J170  48.26,76.2 90 top
J171  50.8,76.2 90 top
J172  53.34,76.2 90 top
J173  55.88,76.2 90 top
J174  58.42,76.2 90 top
J175  60.96,76.2 90 top
J176  63.5,76.2 90 top
J177  66.04,76.2 90 top
J178  68.58,76.2 90 top
J179  71.12,76.2 90 top
J180  73.66,76.2 90 top
J181  76.2,76.2 90 top
J182  78.74,76.2 90 top
J183  78.74,91.44 0 top
J184  78.74,93.98 0 top
J185  88.9,76.2 90 top
J186  91.44,76.2 90 top
J187  93.98,76.2 90 top
J188  96.52,76.2 90 top
J189  78.74,50.8 0 top
J190  78.74,53.34 0 top
J191  88.9,60.96 90 top
J192  91.44,60.96 90 top
J193  93.98,60.96 90 top
J194  96.52,60.96 90 top
J195  12.7,91.44 180 top
J196  12.7,93.98 180 top
J197  2.54,76.2 90 top
J198  5.08,76.2 90 top
J199  7.62,76.2 90 top
J200  10.16,76.2 90 top
J201  12.7,50.8 0 top
J202  12.7,53.34 0 top
J203  2.54,60.96 90 top
J204  5.08,60.96 90 top
J205  7.62,60.96 90 top
J206  10.16,60.96 90 top
J207  81.28,58.42 90 top
J208  83.82,58.42 90 top
J209  86.36,58.42 90 top
J210  81.28,76.2 90 top
J211  83.82,76.2 90 top
J212  86.36,76.2 90 top
J213  81.28,53.34 0 top
J214  81.28,50.8 0 top
J215  81.28,93.98 0 top
J216  81.28,91.44 0 top

### Tracks (layer width: path | path; a pad name or v marks a point on that pad's centre or on a via)
N$1
  Bottom 0.813: J1.1 J2.1 J2.2 J2.3 J2.4 J2.5 J3.1 J3.2 J3.3 J3.4 J3.5 J4.1 J4.2 J4.3 J4.4 J4.5 J5.1 J5.2 J5.3 J5.4 J5.5 J6.1 J6.2 J6.3 J6.4 J6.5 J7.1 J52.1 J52.2 J52.3
N$2
  Bottom 0.813: J8.1 J9.1 J9.2 J9.3 J9.4 J9.5 J10.1 J10.2 J10.3 J10.4 J10.5 J11.1 J11.2 J11.3 J11.4 J11.5 J12.1 J12.2 J12.3 J12.4 J12.5 J13.1 J13.2 J13.3 J13.4 J13.5 J14.1 J51.1 J51.2 J51.3
N$3
  Bottom 0.813: J15.1 J16.1 J16.2 J16.3 J16.4 J16.5 J17.1 J17.2 J17.3 J17.4 J17.5 J18.1 J18.2 J18.3 J18.4 J18.5 J19.1 J19.2 J19.3 J19.4 J19.5 J20.1 J20.2 J20.3 J20.4 J20.5 J21.1 J54.1 J54.2 J54.3
N$4
  Bottom 0.813: J22.1 J23.1 J23.2 J23.3 J23.4 J23.5 J24.1 J24.2 J24.3 J24.4 J24.5 J25.1 J25.2 J25.3 J25.4 J25.5 J26.1 J26.2 J26.3 J26.4 J26.5 J27.1 J27.2 J27.3 J27.4 J27.5 J28.1 J53.1 J53.2 J53.3
N$5
  Bottom 0.813: J41.4 J41.3 J41.2 J41.1
N$6
  Bottom 0.813: J42.4 J42.3 J42.2 J42.1
N$7
  Bottom 0.813: J43.1 J43.2 J43.3 J43.4
N$8
  Bottom 0.813: J44.4 J44.3 J44.2 J44.1
N$9
  Bottom 0.813: J61.5 J61.4 J61.3 J61.2 J61.1
N$10
  Bottom 0.813: J62.1 J62.2 J62.3 J62.4 J62.5
N$11
  Bottom 0.813: J63.5 J63.4 J63.3 J63.2 J63.1
N$12
  Bottom 0.813: J64.1 J64.2 J64.3 J64.4 J64.5
N$13
  Bottom 0.813: J65.5 J65.4 J65.3 J65.2 J65.1
N$14
  Bottom 0.813: J66.1 J66.2 J66.3 J66.4 J66.5
N$15
  Bottom 0.813: J67.5 J67.4 J67.3 J67.2 J67.1
N$16
  Bottom 0.813: J68.1 J68.2 J68.3 J68.4 J68.5
N$17
  Bottom 0.813: J69.5 J69.4 J69.3 J69.2 J69.1
N$18
  Bottom 0.813: J70.1 J70.2 J70.3 J70.4 J70.5
N$19
  Bottom 0.813: J71.5 J71.4 J71.3 J71.2 J71.1
N$20
  Bottom 0.813: J72.1 J72.2 J72.3 J72.4 J72.5
N$21
  Bottom 0.813: J73.5 J73.4 J73.3 J73.2 J73.1
N$22
  Bottom 0.813: J74.1 J74.2 J74.3 J74.4 J74.5
N$23
  Bottom 0.813: J75.5 J75.4 J75.3 J75.2 J75.1
N$24
  Bottom 0.813: J76.1 J76.2 J76.3 J76.4 J76.5
N$25
  Bottom 0.813: J77.5 J77.4 J77.3 J77.2 J77.1
N$26
  Bottom 0.813: J78.1 J78.2 J78.3 J78.4 J78.5
N$27
  Bottom 0.813: J79.5 J79.4 J79.3 J79.2 J79.1
N$28
  Bottom 0.813: J80.1 J80.2 J80.3 J80.4 J80.5
N$29
  Bottom 0.813: J81.5 J81.4 J81.3 J81.2 J81.1
N$30
  Bottom 0.813: J82.1 J82.2 J82.3 J82.4 J82.5
N$31
  Bottom 0.813: J83.5 J83.4 J83.3 J83.2 J83.1
N$32
  Bottom 0.813: J84.1 J84.2 J84.3 J84.4 J84.5
N$33
  Bottom 0.813: J85.5 J85.4 J85.3 J85.2 J85.1
N$34
  Bottom 0.813: J86.1 J86.2 J86.3 J86.4 J86.5
N$35
  Bottom 0.813: J87.5 J87.4 J87.3 J87.2 J87.1
N$36
  Bottom 0.813: J33.1 J33.2 J33.3 J33.4
N$37
  Bottom 0.813: J34.4 J34.3 J34.2 J34.1
N$38
  Bottom 0.813: J35.1 J35.2 J35.3 J35.4
N$39
  Bottom 0.813: J36.4 J36.3 J36.2 J36.1
N$40
  Bottom 0.813: J37.1 J37.2 J37.3 J37.4
N$41
  Bottom 0.813: J38.4 J38.3 J38.2 J38.1
N$42
  Bottom 0.813: J39.1 J39.2 J39.3 J39.4
N$43
  Bottom 0.813: J40.4 J40.3 J40.2 J40.1
N$44
  Bottom 0.813: J96.1 J96.2 J96.3 J96.4 J96.5
N$45
  Bottom 0.813: J97.1 J97.2 J97.3 J97.4 J97.5
N$46
  Bottom 0.813: J98.1 J98.2 J98.3 J98.4 J98.5
N$47
  Bottom 0.813: J99.5 J99.4 J99.3 J99.2 J99.1
N$48
  Bottom 0.813: J100.1 J100.2 J100.3 J100.4 J100.5
N$49
  Bottom 0.813: J101.5 J101.4 J101.3 J101.2 J101.1
N$50
  Bottom 0.813: J102.1 J102.2 J102.3 J102.4 J102.5
N$51
  Bottom 0.813: J103.5 J103.4 J103.3 J103.2 J103.1
N$52
  Bottom 0.813: J104.1 J104.2 J104.3 J104.4 J104.5
N$53
  Bottom 0.813: J105.5 J105.4 J105.3 J105.2 J105.1
N$54
  Bottom 0.813: J106.1 J106.2 J106.3 J106.4 J106.5
N$55
  Bottom 0.813: J107.5 J107.4 J107.3 J107.2 J107.1
N$56
  Bottom 0.813: J108.1 J108.2 J108.3 J108.4 J108.5
N$57
  Bottom 0.813: J109.5 J109.4 J109.3 J109.2 J109.1
N$58
  Bottom 0.813: J110.1 J110.2 J110.3 J110.4 J110.5
N$59
  Bottom 0.813: J111.5 J111.4 J111.3 J111.2 J111.1
N$60
  Bottom 0.813: J112.1 J112.2 J112.3 J112.4 J112.5
N$61
  Bottom 0.813: J113.5 J113.4 J113.3 J113.2 J113.1
N$62
  Bottom 0.813: J114.1 J114.2 J114.3 J114.4 J114.5
N$63
  Bottom 0.813: J115.5 J115.4 J115.3 J115.2 J115.1
N$64
  Bottom 0.813: J116.1 J116.2 J116.3 J116.4 J116.5
N$65
  Bottom 0.813: J117.5 J117.4 J117.3 J117.2 J117.1
N$66
  Bottom 0.813: J118.1 J118.2 J118.3 J118.4 J118.5
N$67
  Bottom 0.813: J119.5 J119.4 J119.3 J119.2 J119.1
N$68
  Bottom 0.813: J120.1 J120.2 J120.3 J120.4 J120.5
N$69
  Bottom 0.813: J121.5 J121.4 J121.3 J121.2 J121.1
N$70
  Bottom 0.813: J122.1 J122.2 J122.3 J122.4 J122.5
N$71
  Bottom 0.813: J29.4 J29.3 J29.2 J29.1
N$72
  Bottom 0.813: J30.1 J30.2 J30.3 J30.4
N$73
  Bottom 0.813: J31.4 J31.3 J31.2 J31.1
N$74
  Bottom 0.813: J32.1 J32.2 J32.3 J32.4
N$75
  Bottom 0.813: J48.5 J48.4 J48.3 J48.2 J48.1
N$76
  Bottom 0.813: J45.1 J45.2 J45.3 J45.4 J45.5
N$77
  Bottom 0.813: J46.5 J46.4 J46.3 J46.2 J46.1
N$78
  Bottom 0.813: J47.1 J47.2 J47.3 J47.4 J47.5
N$79
  Bottom 0.813: J49.1 J49.2 J49.3 J49.4 J49.5
N$80
  Bottom 0.813: J50.5 J50.4 J50.3 J50.2 J50.1
N$81
  Bottom 0.813: J201.1 J55.1 J55.2 J55.3 J55.4 J55.5 J56.1 J56.2 J56.3 J56.4 J56.5 J57.1 J57.2 J57.3 J57.4 J57.5 J58.1 J58.2 J58.3 J58.4 J58.5 J59.1 J59.2 J59.3 J59.4 J59.5 J189.1 J214.1 J214.2 J214.3
N$82
  Bottom 0.813: J202.1 J60.1 J60.2 J60.3 J60.4 J60.5 J88.1 J88.2 J88.3 J88.4 J88.5 J89.1 J89.2 J89.3 J89.4 J89.5 J90.1 J90.2 J90.3 J90.4 J90.5 J91.1 J91.2 J91.3 J91.4 J91.5 J190.1 J213.1 J213.2 J213.3
N$83
  Bottom 0.813: J195.1 J92.1 J92.2 J92.3 J92.4 J92.5 J93.1 J93.2 J93.3 J93.4 J93.5 J94.1 J94.2 J94.3 J94.4 J94.5 J95.1 J95.2 J95.3 J95.4 J95.5 J123.1 J123.2 J123.3 J123.4 J123.5 J183.1 J216.1 J216.2 J216.3
N$84
  Bottom 0.813: J196.1 J124.1 J124.2 J124.3 J124.4 J124.5 J125.1 J125.2 J125.3 J125.4 J125.5 J126.1 J126.2 J126.3 J126.4 J126.5 J127.1 J127.2 J127.3 J127.4 J127.5 J128.1 J128.2 J128.3 J128.4 J128.5 J184.1 J215.1 J215.2 J215.3
N$85
  Bottom 0.813: J203.4 J203.3 J203.2 J203.1
N$86
  Bottom 0.813: J204.4 J204.3 J204.2 J204.1
N$87
  Bottom 0.813: J205.1 J205.2 J205.3 J205.4
N$88
  Bottom 0.813: J206.4 J206.3 J206.2 J206.1
N$89
  Bottom 0.813: J129.5 J129.4 J129.3 J129.2 J129.1
N$90
  Bottom 0.813: J130.1 J130.2 J130.3 J130.4 J130.5
N$91
  Bottom 0.813: J131.5 J131.4 J131.3 J131.2 J131.1
N$92
  Bottom 0.813: J132.1 J132.2 J132.3 J132.4 J132.5
N$93
  Bottom 0.813: J133.5 J133.4 J133.3 J133.2 J133.1
N$94
  Bottom 0.813: J134.1 J134.2 J134.3 J134.4 J134.5
N$95
  Bottom 0.813: J135.5 J135.4 J135.3 J135.2 J135.1
N$96
  Bottom 0.813: J136.1 J136.2 J136.3 J136.4 J136.5
N$97
  Bottom 0.813: J137.5 J137.4 J137.3 J137.2 J137.1
N$98
  Bottom 0.813: J138.1 J138.2 J138.3 J138.4 J138.5
N$99
  Bottom 0.813: J139.5 J139.4 J139.3 J139.2 J139.1
N$100
  Bottom 0.813: J140.1 J140.2 J140.3 J140.4 J140.5
N$101
  Bottom 0.813: J141.5 J141.4 J141.3 J141.2 J141.1
N$102
  Bottom 0.813: J142.1 J142.2 J142.3 J142.4 J142.5
N$103
  Bottom 0.813: J143.5 J143.4 J143.3 J143.2 J143.1
N$104
  Bottom 0.813: J144.1 J144.2 J144.3 J144.4 J144.5
N$105
  Bottom 0.813: J145.5 J145.4 J145.3 J145.2 J145.1
N$106
  Bottom 0.813: J146.1 J146.2 J146.3 J146.4 J146.5
N$107
  Bottom 0.813: J147.5 J147.4 J147.3 J147.2 J147.1
N$108
  Bottom 0.813: J148.1 J148.2 J148.3 J148.4 J148.5
N$109
  Bottom 0.813: J149.5 J149.4 J149.3 J149.2 J149.1
N$110
  Bottom 0.813: J150.1 J150.2 J150.3 J150.4 J150.5
N$111
  Bottom 0.813: J151.5 J151.4 J151.3 J151.2 J151.1
N$112
  Bottom 0.813: J152.1 J152.2 J152.3 J152.4 J152.5
N$113
  Bottom 0.813: J153.5 J153.4 J153.3 J153.2 J153.1
N$114
  Bottom 0.813: J154.1 J154.2 J154.3 J154.4 J154.5
N$115
  Bottom 0.813: J155.5 J155.4 J155.3 J155.2 J155.1
N$116
  Bottom 0.813: J191.1 J191.2 J191.3 J191.4
N$117
  Bottom 0.813: J192.4 J192.3 J192.2 J192.1
N$118
  Bottom 0.813: J193.1 J193.2 J193.3 J193.4
N$119
  Bottom 0.813: J194.4 J194.3 J194.2 J194.1
N$120
  Bottom 0.813: J197.1 J197.2 J197.3 J197.4
N$121
  Bottom 0.813: J198.4 J198.3 J198.2 J198.1
N$122
  Bottom 0.813: J199.1 J199.2 J199.3 J199.4
N$123
  Bottom 0.813: J200.4 J200.3 J200.2 J200.1
N$124
  Bottom 0.813: J156.1 J156.2 J156.3 J156.4 J156.5
N$125
  Bottom 0.813: J157.1 J157.2 J157.3 J157.4 J157.5
N$126
  Bottom 0.813: J158.1 J158.2 J158.3 J158.4 J158.5
N$127
  Bottom 0.813: J159.5 J159.4 J159.3 J159.2 J159.1
N$128
  Bottom 0.813: J160.1 J160.2 J160.3 J160.4 J160.5
N$129
  Bottom 0.813: J161.5 J161.4 J161.3 J161.2 J161.1
N$130
  Bottom 0.813: J162.1 J162.2 J162.3 J162.4 J162.5
N$131
  Bottom 0.813: J163.5 J163.4 J163.3 J163.2 J163.1
N$132
  Bottom 0.813: J164.1 J164.2 J164.3 J164.4 J164.5
N$133
  Bottom 0.813: J165.5 J165.4 J165.3 J165.2 J165.1
N$134
  Bottom 0.813: J166.1 J166.2 J166.3 J166.4 J166.5
N$135
  Bottom 0.813: J167.5 J167.4 J167.3 J167.2 J167.1
N$136
  Bottom 0.813: J168.1 J168.2 J168.3 J168.4 J168.5
N$137
  Bottom 0.813: J169.5 J169.4 J169.3 J169.2 J169.1
N$138
  Bottom 0.813: J170.1 J170.2 J170.3 J170.4 J170.5
N$139
  Bottom 0.813: J171.5 J171.4 J171.3 J171.2 J171.1
N$140
  Bottom 0.813: J172.1 J172.2 J172.3 J172.4 J172.5
N$141
  Bottom 0.813: J173.5 J173.4 J173.3 J173.2 J173.1
N$142
  Bottom 0.813: J174.1 J174.2 J174.3 J174.4 J174.5
N$143
  Bottom 0.813: J175.5 J175.4 J175.3 J175.2 J175.1
N$144
  Bottom 0.813: J176.1 J176.2 J176.3 J176.4 J176.5
N$145
  Bottom 0.813: J177.5 J177.4 J177.3 J177.2 J177.1
N$146
  Bottom 0.813: J178.1 J178.2 J178.3 J178.4 J178.5
N$147
  Bottom 0.813: J179.5 J179.4 J179.3 J179.2 J179.1
N$148
  Bottom 0.813: J180.1 J180.2 J180.3 J180.4 J180.5
N$149
  Bottom 0.813: J181.5 J181.4 J181.3 J181.2 J181.1
N$150
  Bottom 0.813: J182.1 J182.2 J182.3 J182.4 J182.5
N$151
  Bottom 0.813: J185.4 J185.3 J185.2 J185.1
N$152
  Bottom 0.813: J186.1 J186.2 J186.3 J186.4
N$153
  Bottom 0.813: J187.4 J187.3 J187.2 J187.1
N$154
  Bottom 0.813: J188.1 J188.2 J188.3 J188.4
N$155
  Bottom 0.813: J207.1 J207.2 J207.3 J207.4 J207.5
N$156
  Bottom 0.813: J208.5 J208.4 J208.3 J208.2 J208.1
N$157
  Bottom 0.813: J209.1 J209.2 J209.3 J209.4 J209.5
N$158
  Bottom 0.813: J210.5 J210.4 J210.3 J210.2 J210.1
N$159
  Bottom 0.813: J211.1 J211.2 J211.3 J211.4 J211.5
N$160
  Bottom 0.813: J212.5 J212.4 J212.3 J212.2 J212.1

### Text on the board
bPlace: 1 | 5 | 10 | 15 | 20 | 25 | 30 | 35 | 1 | 5 | 10 | 15 | 20 | 25 | 30 | 35
tNames: Max current through any trace (based on width): 3.5A (temperature rise: 35 deg C) | Max voltage between any two traces (based on clearance): 100V (70 V_AC RMS) | 1 | 5 | 10 | 15 | 20 | 25 | 30 | 35 | For more information: github.com/nathancharlesjones/Embedded-for-Everyone/wiki | Max current through any trace (based on width): 3.5A (temperature rise: 35 deg C) | Max voltage between any two traces (based on clearance): 100V (70 V_AC RMS) | 1 | 5 | 10 | 15 | 20 | 25 | 30 | 35 | For more information: github.com/nathancharlesjones/Embedded-for-Everyone/wiki
bNames: TRACES / THIS / SIDE | TRACES / THIS / SIDE | TRACES / THIS / SIDE | TRACES / THIS / SIDE